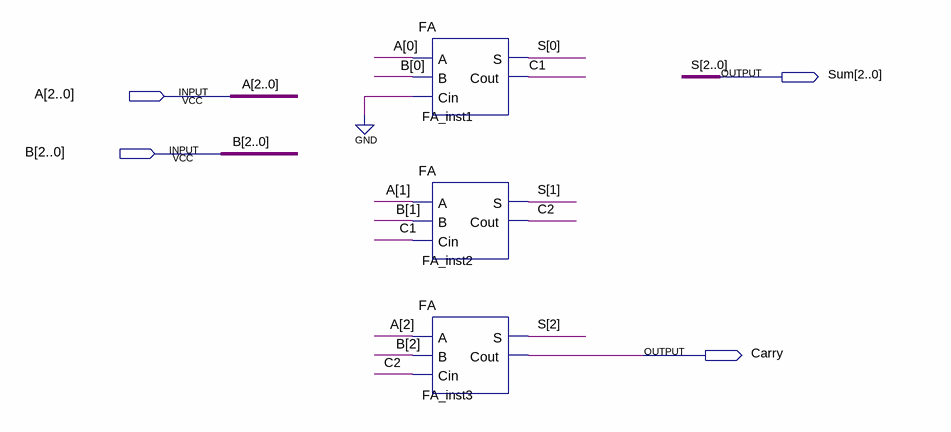
[diagram p0: schematic sheet]
// Quartus schematic Adder3bit.bdf as structural Verilog: 3 symbols, 4 pins
module Adder3bit (
  input  [2:0] A,
  input  [2:0] B,
  output [2:0] Sum,
  output Carry
);

  wire C1, C2;

  FA FA_inst1 (.A(A[0]), .B(B[0]), .Cin(1'b0), .S(Sum[0]), .Cout(C1));
  FA FA_inst2 (.A(A[1]), .B(B[1]), .Cin(C1), .S(Sum[1]), .Cout(C2));
  FA FA_inst3 (.A(A[2]), .B(B[2]), .Cin(C2), .S(Sum[2]), .Cout(Carry));

  // Other names for the same wires on the sheet: S[2:0] = Sum
endmodule
